# Altium schematic sheet USB_Type_C.SchDoc: USB_Type_C
size A4; Date: Not used; ApprovedBy: Not used; CheckedBy: Not used; Author: Not used; CompanyName: STMicroelectronics; DrawnBy: Not used; Engineer: Not used; Organization: Not used; Address1: Not used; Address2: Not used; Address3: Not used; Address4: Not used; DocumentNumber: 7; Revision: Not used; SheetNumber: 7; SheetTotal: 9; CurrentTime: Not used; CurrentDate: Not used; Time: Not used; DocumentFullPathAndName: Not used; DocumentName: Not used; ModifiedDate: Not used; ImagePath: Not used; ProjectName: Not used; Application_BuildNumber: Not used
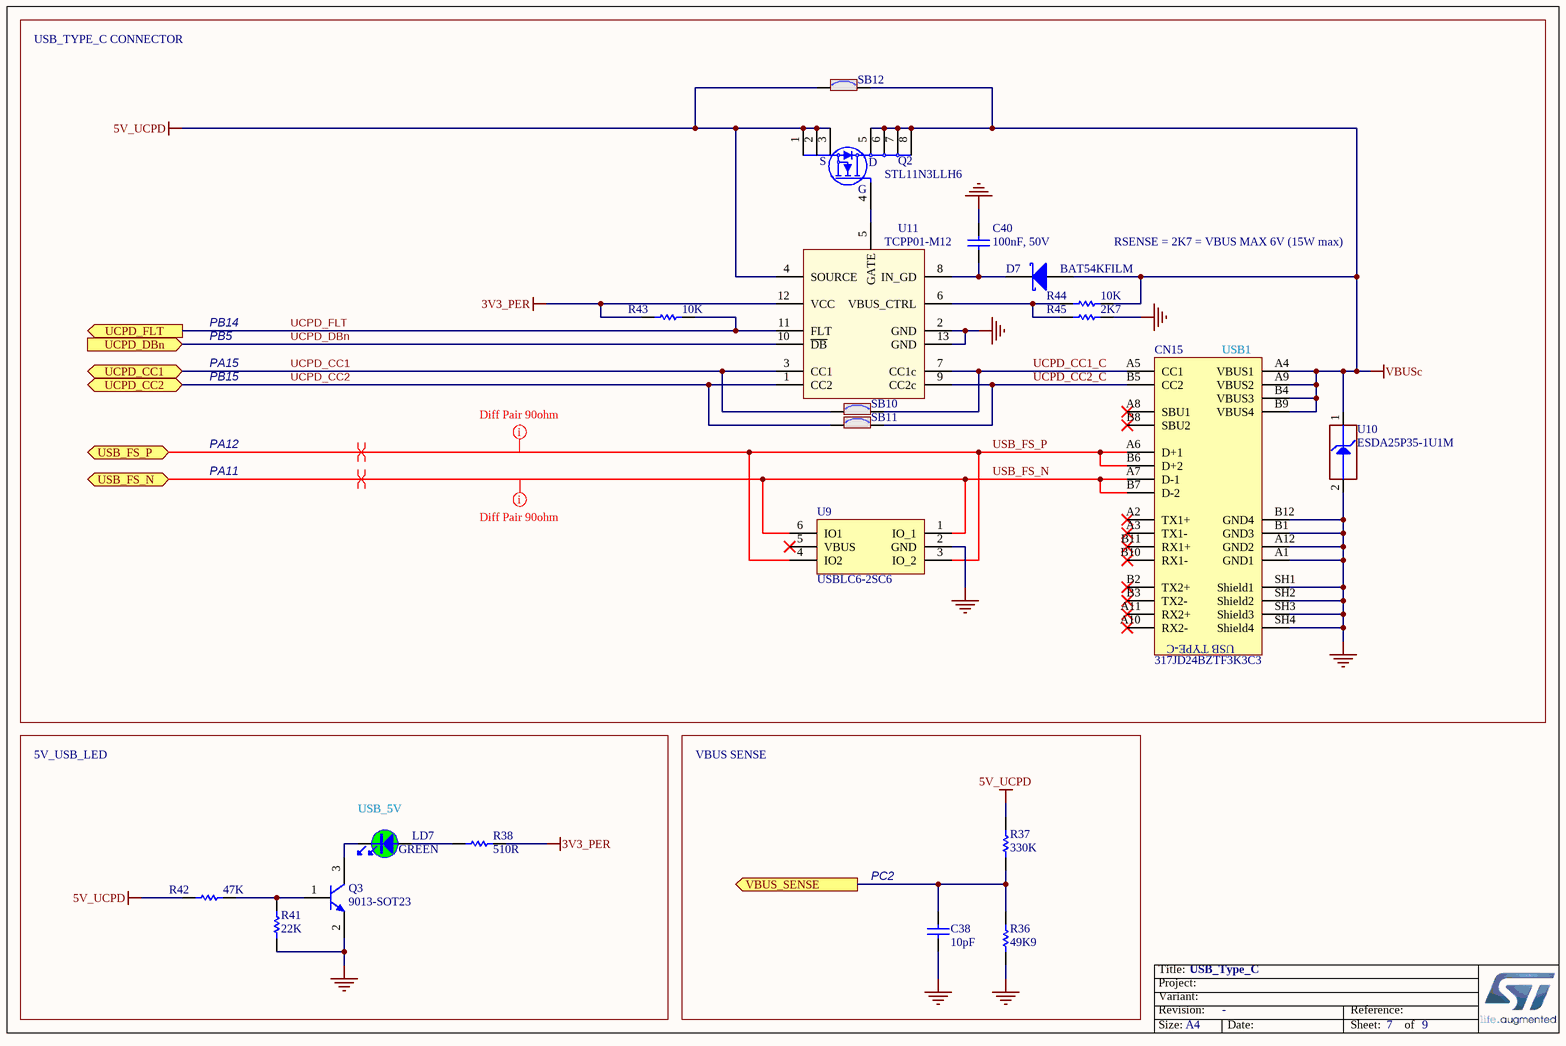
[diagram p0: USB_Type_C.SchDoc]

## Parts
C38  value 10pF  [C0603]
C40  value 100nF, 50V  [C0603]  (hidden comment: Capacitor)
CN15  value 317JD24BZTF3K3C3  [CON_USB-TYPEC_COXOC_317JD24BZTF3K3C3]  (hidden comment: USB_TYPE_C_Receptacle_317JD24BZTF3K3C3)
D7  value BAT54KFILM  [DIO_SOD523_1A_2K]  (hidden comment: SCHOTTKY_1A_2K)
LD7  value GREEN  [LED_0603_GREEN]
Q2  STL11N3LLH6  [MOS_POWERFLAT_3P3X3P3_P065]
Q3  value 9013-SOT23  [NPN_SOT23]
R36  value 49K9  [R0603]
R37  value 330K  [R0603]
R38  value 510R  [R0603]
R41  value 22K  [R0603]
R42  value 47K  [R0603]
R43  value 10K  [R0603]  (hidden comment: Resistor)
R44  value 10K  [R0603]  (hidden comment: Resistor)
R45  value 2K7  [R0603]  (hidden comment: Resistor)
SB10  (no value)  [SOLDER-BRIDGE_R0603-0R]
SB11  (no value)  [SOLDER-BRIDGE_R0603-0R]
SB12  (no value)  [SOLDER-BRIDGE_R0603-0R]
U9  USBLC6-2SC6  [ESD_SOT23-6L]
U10  value ESDA25P35-1U1M  [ESD_QFN1610_2N_1K_2A]  (hidden comment: ESD-TRANSIL)
U11  TCPP01-M12  [ICC_QFN12L-EPAD_3X3_P050]

## Ports
UCPD_CC1 (bidir), UCPD_CC2 (bidir), UCPD_DBn, UCPD_FLT, USB_FS_N (bidir), USB_FS_P (bidir), VBUS_SENSE

## Nets
3V3_PER: R38.1 R43.2 U11.12(VCC)
5V_UCPD: Q2.1(S) Q2.2(S) Q2.3(S) R37.2 R42.1 SB12.1 U11.4(SOURCE)
GND: C38.1 C40.1 CN15.A1(GND1) CN15.A12(GND2) CN15.B1(GND3) CN15.B12(GND4) CN15.SH1(Shield1) CN15.SH2(Shield2) CN15.SH3(Shield3) CN15.SH4(Shield4) Q3.2(E) R36.1 R41.1 R45.1 U9.2(GND) U10.2(GND) U11.2(GND) U11.13(GND)
VBUSc: CN15.A4(VBUS1) CN15.A9(VBUS2) CN15.B4(VBUS3) CN15.B9(VBUS4) D7.1(A) Q2.5(D) Q2.6(D) Q2.7(D) Q2.8(D) R44.2 SB12.2 U10.1(IO1)
UCPD_CC1: SB10.1 U11.3(CC1) ; port UCPD_CC1
UCPD_CC1_C: CN15.A5(CC1) SB10.2 U11.7(CC1c)
UCPD_CC2: SB11.1 U11.1(CC2) ; port UCPD_CC2
UCPD_CC2_C: CN15.B5(CC2) SB11.2 U11.9(CC2c)
UCPD_DBn: U11.10(~{DB}) ; port UCPD_DBn
UCPD_FLT: R43.1 U11.11(FLT) ; port UCPD_FLT
USB_FS_N: CN15.A7(D-1) CN15.B7(D-2) U9.1(IO_1) U9.6(IO1) ; port USB_FS_N
USB_FS_P: CN15.A6(D+1) CN15.B6(D+2) U9.3(IO_2) U9.4(IO2) ; port USB_FS_P
VBUS_SENSE: C38.2 R36.2 R37.1 ; port VBUS_SENSE
NetC40_2: C40.2 D7.2(K) U11.8(IN_GD)
NetLD7_1: LD7.1 R38.2
NetLD7_2: LD7.2 Q3.3(C)
NetQ2_4: Q2.4(G) U11.5(GATE)
NetQ3_1: Q3.1(B) R41.2 R42.2
NetR44_1: R44.1 R45.2 U11.6(VBUS_CTRL)

Not connected (* = marked no-connect by the designer): CN15 A2(TX1+)* A3(TX1-)* A8(SBU1)* A10(RX2-)* A11(RX2+)* B2(TX2+)* B3(TX2-)* B8(SBU2)* B10(RX1-)* B11(RX1+)*; U9 5(VBUS)*

## Layout directives
mark named Diff Pair 90ohm: USB_FS_N, USB_FS_P
differential pair: USB_FS_N, USB_FS_P

## Notes on the sheet
- USB_TYPE_C CONNECTOR
- RSENSE = 2K7 = VBUS MAX 6V (15W max)
- PA15
- PB15
- PB14
- PB5
- (near CN15) USB1
- PA12
- PA11
- 5V_USB_LED
- VBUS SENSE
- (near LD7) USB_5V
- PC2
- Title:
- Project:
- Size:
- Revision:
- Variant:
- A4
- -
- Date:
- Reference:
- Sheet:
- of
- (in symbol MCD-01108) USB TYPE-C

## Library data of the parts
C38 = MCD-00637: Capacitor, MLCC, 10pF, 50V, NPO, 5%, 0603, T=0,8mm; Manufacturer_Part_Number: CC0603JRNPO9BN100; Manufacturer: YAGEO; Provided_By: subcon; Initial_Board_Reference: MB1319; Internal_Part_Number: MCD-00637; Status: Released; Part_Type: Capacitor; Package: C0603; ComponentLink1Description: Datasheet; ComponentLink1URL: http://tunmcdsvn.tun.st.com/Component_Datasheet_Library/Trunk/Capacitors/Yageo_Capacitor_NP0_16V-to-50V; ECCN_US: n/a; ECCN_EU: n/a
C40 = MCD-01099: Capacitor,100nF,50V,X7R,10%,0603; Manufacturer_Part_Number: CC0603KRX7R9BB104; Manufacturer: YAGEO; Provided_By: SUBCO; Internal_Part_Number: MCD-01099; Status: Released; Part_Type: Capacitor; Package: C0603; ComponentLink1Description: Datasheet; ComponentLink1URL: http://tunmcdsvn.tun.st.com/Component_Datasheet_Library/Trunk/Capacitors/Yageo_Multilayer_Capacitor_X7R_series_100pF_to_22uF/Yageo_Mutilayer_Capacitor_X7R_100pF_to_22uF.pdf; ECCN_US: N/A; ECCN_EU: N/A
CN15 = MCD-01108: USB tyce C certified receptacle for 1.6mm pcb height; Part_Type: Connector; Manufacturer: CHANT SINCERE (COXOC); Provided_By: SUBCO; Internal_Part_Number: MCD-01108; Status: Released; Manufacturer_Part_Number: 317JD24BZTF3K3C3; ComponentLink1Description: Datasheet; ComponentLink1URL: http://tunmcdsvn.tun.st.com/Component_Datasheet_Library/Trunk/Connectors/Chant%20sincere_usb%20type%20C%20connector%20317JD24BZTF3K3C3; ECCN_US: n/a; ECCN_EU: n/a
D7 = MCD-01677: Small signal Schottky diodes; Part_Type: Diode; Manufacturer: STMICROELECTRONICS; ECCN_US: EAR99; ECCN_EU: NEC; Provided_By: SUBCO; Internal_Part_Number: MCD-01677; Status: Checked; Manufacturer_Part_Number: BAT54KFILM; Package: SOD-523; ComponentLink1Description: Datasheet; ComponentLink1URL: http://tunmcdsvn.tun.st.com/Component_Datasheet_Library/Trunk/Diodes/STM_SCHOTTKY_DOUBLE_BAT54SWFILM/STM_SCHOTTKY_DOUBLE_BAT54SWFILM.pdf
LD7 = MCD-00050: LED, Green, 0603; Part_Type: Display; Manufacturer_Part_Number: 19-213SYGC/S530-E2/TR8; Manufacturer: EVERLIGHT; ECCN_US: EAR99; ECCN_EU: NEC; Provided_By: Subcon; Initial_Board_Reference: MB1274; Internal_Part_Number: MCD-00050; Status: Released; ComponentLink1Description: Datasheet; Package: LED 0603; ComponentLink1URL: http://tunmcdsvn.tun.st.com/Component_Datasheet_Library/Trunk/Display/Everlight_SMD-LED-GREEN_19-213SYGC-S530-XX-TR8-v3.doc
Q2 = MCD-01810: N-channel 30 V, 6 mΩ typ, 11 A STripFET™ H6, Power MOSFET in a PowerFLAT™ 3.3x3.3 package; Part_Type: IC; Manufacturer: STMICROELECTRONICS; ECCN_US: EAR99; ECCN_EU: NEC; Provided_By: SUBCO with ST control; Internal_Part_Number: MCD-01810; Value: STL11N3LLH6; Status: Checked; Manufacturer_Part_Number: STL11N3LLH6; Package: PowerFLAT 3.3x3.3; ComponentLink1Description: Datasheet; ComponentLink1URL: http://tunmcdsvn.tun.st.com/Component_Datasheet_Library/Trunk/IC/STM_POWER_MOSFET_STL11N3LLH6
Q3 = MCD-00073: NPN Bipolar Transistor; Part_Type: IC; Manufacturer_Part_Number: BSR14; Manufacturer: NXP; ECCN_US: EAR99; ECCN_EU: NEC; Provided_By: Subcon; Initial_Board_Reference: MB1274; Revision: *; Internal_Part_Number: MCD-00073; Status: Released; ComponentLink1Description: Datasheet; ComponentLink1URL: http://tunmcdsvn.tun.st.com/Component_Datasheet_Library/Trunk/IC/NXP_Transistor_BSR14
R36 = MCD-01171: Resistor,49K9,0603,1%; Manufacturer_Part_Number: RC0603FR-0749K9L; Manufacturer: YAGEO; Provided_By: Subcon; Initial_Board_Reference: MB1397; Internal_Part_Number: MCD-01171; Status: Released; Part_Type: Resistor; Package: R0603; ComponentLink1Description: Datasheet; ComponentLink1URL: http://tunmcdsvn.tun.st.com/Component_Datasheet_Library/Trunk/Resistors/Yageo_Resistor_RC0603-series/; ECCN_US: n/a; ECCN_EU: n/a
R37 = MCD-00458: Resistor,330K,0603,1%,1/10W; Manufacturer_Part_Number: RC0603FR-07330KL; Manufacturer: YAGEO; Provided_By: Subcon; Internal_Part_Number: MCD-00458; Status: Released; Part_Type: Resistor; Package: R0603; ComponentLink1Description: Datasheet; ComponentLink1URL: http://tunmcdsvn.tun.st.com/Component_Datasheet_Library/Trunk/Resistors/Yageo_Resistor_RC0603-series; ECCN_US: n/a; ECCN_EU: n/a
R38 = MCD-00225: Resistor,510R,0603,1%,1/10W; Manufacturer_Part_Number: RC0603FR-07510RL; Manufacturer: YAGEO; Provided_By: Subcon; Initial_Board_Reference: MB1319; Internal_Part_Number: MCD-00225; Status: Released; Part_Type: Resistor; ComponentLink1Description: Datasheet; ECCN_US: n/a; ECCN_EU: n/a; Package: R0603; ComponentLink1URL: http://tunmcdsvn.tun.st.com/Component_Datasheet_Library/Trunk/Resistors/Yageo_Resistor_RC0603-series
R41 = MCD-00430: Resistor,22K,0603,1%,1/10W; Manufacturer_Part_Number: RC0603FR-0722KL; Manufacturer: YAGEO; Provided_By: Subcon; Internal_Part_Number: MCD-00430; Status: Released; Part_Type: Resistor; ComponentLink1Description: Datasheet; ECCN_US: n/a; ECCN_EU: n/a; Package: R0603; ComponentLink1URL: http://tunmcdsvn.tun.st.com/Component_Datasheet_Library/Trunk/Resistors/Yageo_Resistor_RC0603-series
R42 = MCD-00222: Resistor,47K,0603,1%,1/10W; Manufacturer_Part_Number: RC0603FR-0747KL; Manufacturer: YAGEO; Provided_By: Subcon; Initial_Board_Reference: MB1319; Internal_Part_Number: MCD-00222; Status: Released; Part_Type: Resistor; ComponentLink1Description: Datasheet; ECCN_US: n/a; ECCN_EU: n/a; Package: R0603; ComponentLink1URL: http://tunmcdsvn.tun.st.com/Component_Datasheet_Library/Trunk/Resistors/Yageo_Resistor_RC0603-series
R43 R44 = MCD-00220: Resistor,10K,0603,1%,1/10W; Manufacturer_Part_Number: RC0603FR-0710KL; Manufacturer: YAGEO; ECCN_US: EAR99; ECCN_EU: NEC; Provided_By: SUBCO; Internal_Part_Number: MCD-00220; Status: Released; Part_Type: Resistor; Package: R0603; ComponentLink1Description: Datasheet; ComponentLink1URL: http://tunmcdsvn.tun.st.com/Component_Datasheet_Library/Trunk/Resistors/Yageo_Resistor_RC0603-series
R45 = MCD-00218: Resistor,2K7,0603,1%,1/10W; Manufacturer_Part_Number: RC0603FR-072K7L; Manufacturer: YAGEO; BMS_Part_Number: 9129767; ECCN_US: EAR99; ECCN_EU: NEC; Provided_By: SUBCO; Internal_Part_Number: MCD-00218; Status: Released; Part_Type: Resistor; Package: R0603; ComponentLink1Description: Datasheet; ComponentLink1URL: http://tunmcdsvn.tun.st.com/Component_Datasheet_Library/Trunk/Resistors/Yageo_Resistor_RC0603-series
SB10-SB12 = MCD-00071: Solder Bridge ON; Part_Type: Mechanical; Provided_By: Subcon; Initial_Board_Reference: MB1274; Internal_Part_Number: MCD-00071; Status: Released; ECCN_US: n/a; ECCN_EU: n/a; ComponentLink1Description: Datasheet
U9 = MCD-00163: Very low capacitance ESD protection; Part_Type: IC; Manufacturer: STMICROELECTRONICS; BMS_Part_Number: 9151075; ECCN_US: EAR99; ECCN_EU: NEC; Provided_By: SUBCO with ST control; Internal_Part_Number: MCD-00163; Value: USBLC6-2SC6; Status: Released; Manufacturer_Part_Number: USBLC6-2SC6; ComponentLink1Description: Datasheet; ComponentLink1URL: http://tunmcdsvn.tun.st.com/Component_Datasheet_Library/Trunk/Diodes/STM_ESD_USBLC6-2
U10 = MCD-01207: High power Transient voltage suppressor:25V/35A EOS and ESD transients protection.; Part_Type: Diode; Manufacturer: STMICROELECTRONICS; BMS_Part_Number: 9179045; ECCN_US: EAR99; ECCN_EU: NEC; Provided_By: SUBCO with ST control; Internal_Part_Number: MCD-01207; Status: Checked; Manufacturer_Part_Number: ESDA25P35-1U1M; Package: QFN1610; ComponentLink1Description: Datasheet; ComponentLink1URL: http://tunmcdsvn.tun.st.com/Component_Datasheet_Library/Trunk/Diodes/STM_ESD_ESDA25P35-1U1M
U11 = MCD-01809: USB Type-C Port Protection for USB Power Delivery, PPS compliant; Part_Type: IC; Manufacturer: STMICROELECTRONICS; ECCN_US: EAR99; ECCN_EU: NEC; Provided_By: SUBCO with ST control; Internal_Part_Number: MCD-01809; Value: TCPP01-M12; Status: Checked; Manufacturer_Part_Number: TCPP01-M12; Package: QFN-12L; ComponentLink1Description: Datasheet; ComponentLink1URL: http://tunmcdsvn.tun.st.com/Component_Datasheet_Library/Trunk/IC/STM_UCPD_Protection_TCPP01-M12